# EAGLE design LIN-interface (EAGLE 6.2)
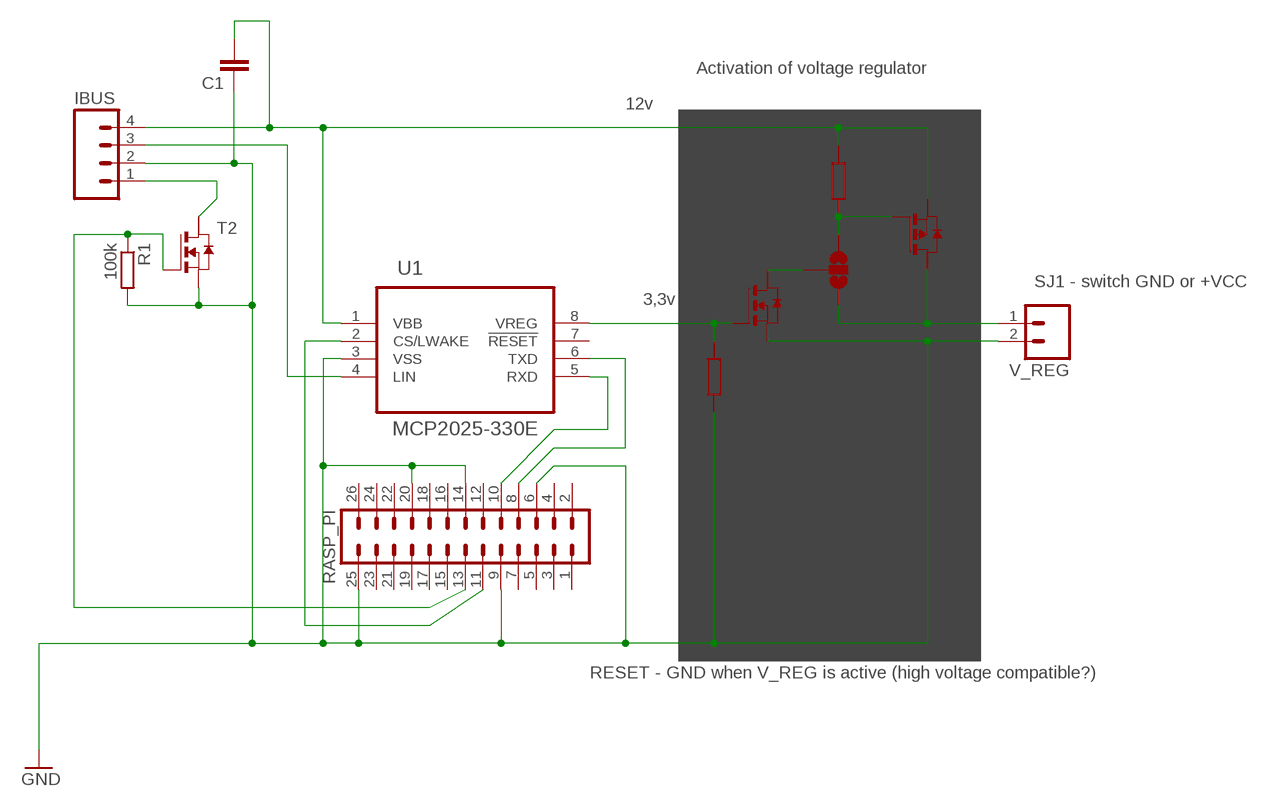
[diagram p0: schematic, sheet 1]

## Parts
C1  C-EUC1812  [C1812]
IBUS  M04  [04P]
R1  100k  R-EU_R5025  [R5025]
R2  100k  R-EU_R5025  [R5025]
R3  100k  R-EU_R5025  [R5025]
RASP_PI  MA13-2MIRRORED  [ML26-MIRRORED]
SJ1  SJ2W  [SJ_2]
T1  NMOSSOT223  [SOT223]
T2  NMOSSOT223  [SOT223]
T3  PMOSSOT223  [SOT223]
U1  MCP2025-330E  MCP2025-330E/PDIP08  [DIL08]
V_REG  M02  [02P]

## Nets
GND: C1.1 IBUS.2 R1.2 R2.2 RASP_PI.6 RASP_PI.9 RASP_PI.14 RASP_PI.20 RASP_PI.25 T1.3(S) T2.3(S) U1.3(VSS) V_REG.2
N$1: IBUS.3 U1.4(LIN)
N$2: SJ1.2 T1.2(D)
N$4: RASP_PI.8 U1.6(TXD)
N$5: RASP_PI.10 U1.5(RXD)
N$6: RASP_PI.11 U1.2(CS/LWAKE)
N$8: SJ1.3 T3.2(D) V_REG.1
N$9: IBUS.1 T2.2(D)
N$10: R3.2 SJ1.1 T3.1(G)
VBB: C1.2 IBUS.4 R3.1 T3.3(S) U1.1(VBB)
VIDEO_ON: R1.1 RASP_PI.13 T2.1(G)
VREG: R2.1 T1.1(G) U1.8(VREG)
Unconnected: RASP_PI.1 RASP_PI.2 RASP_PI.3 RASP_PI.4 RASP_PI.5 RASP_PI.7 RASP_PI.12 RASP_PI.15 RASP_PI.16 RASP_PI.17 RASP_PI.18 RASP_PI.19 RASP_PI.21 RASP_PI.22 RASP_PI.23 RASP_PI.24 RASP_PI.26 T1.4(D2) T2.4(D2) T3.4(D2) U1.7(!RESET)

## Notes on the sheet
- Activation of voltage regulator
- 12v
- SJ1 - switch GND or +VCC
- 3,3v
- RESET - GND when V_REG is active (high voltage compatible?)

## Library data of the parts
C1 = rcl:C-EU: CAPACITOR, European symbol
IBUS = con-amp-quick:M04: AMP QUICK CONNECTOR; OC_FARNELL: unknown; OC_NEWARK: unknown
R1-R3 = resistor:R-EU_: RESISTOR, European symbol
RASP_PI = con-lstb:MA13-2: PIN HEADER
SJ1 = jumper:SJ2W: SMD solder JUMPER
T1 T2 = zetex:NMOSSOT223: MOS FET; OC_FARNELL: unknown; OC_NEWARK: unknown
T3 = zetex:PMOSSOT223: MOS FET; OC_FARNELL: unknown; OC_NEWARK: unknown
U1 = LIN interface:MCP2025-330E/P: LIN Transceiver with Voltage Regulator,DIP-8; MPN: MCP2025-330E/P; OC_FARNELL: 2362832; OC_NEWARK: 12X8692; PACKAGE: DIP08; SUPPLIER: MICROCHIP
V_REG = con-amp-quick:M02: AMP QUICK CONNECTOR; OC_FARNELL: unknown; OC_NEWARK: unknown

## Board
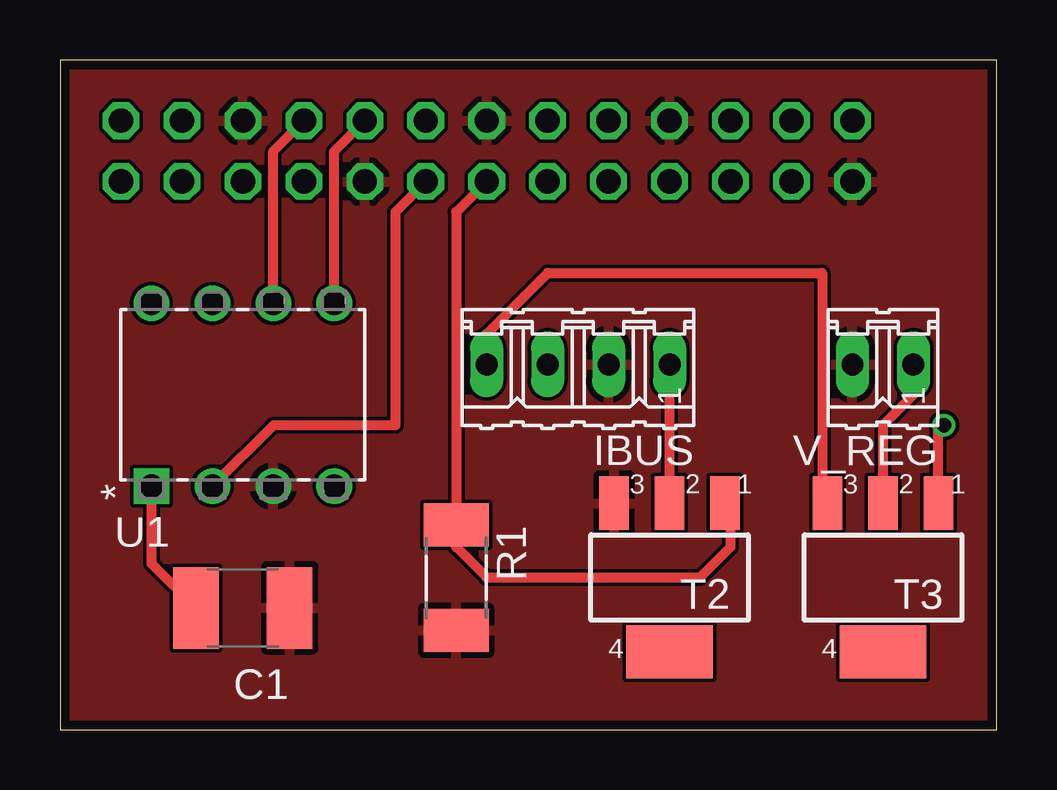
[diagram p1: board, top side]
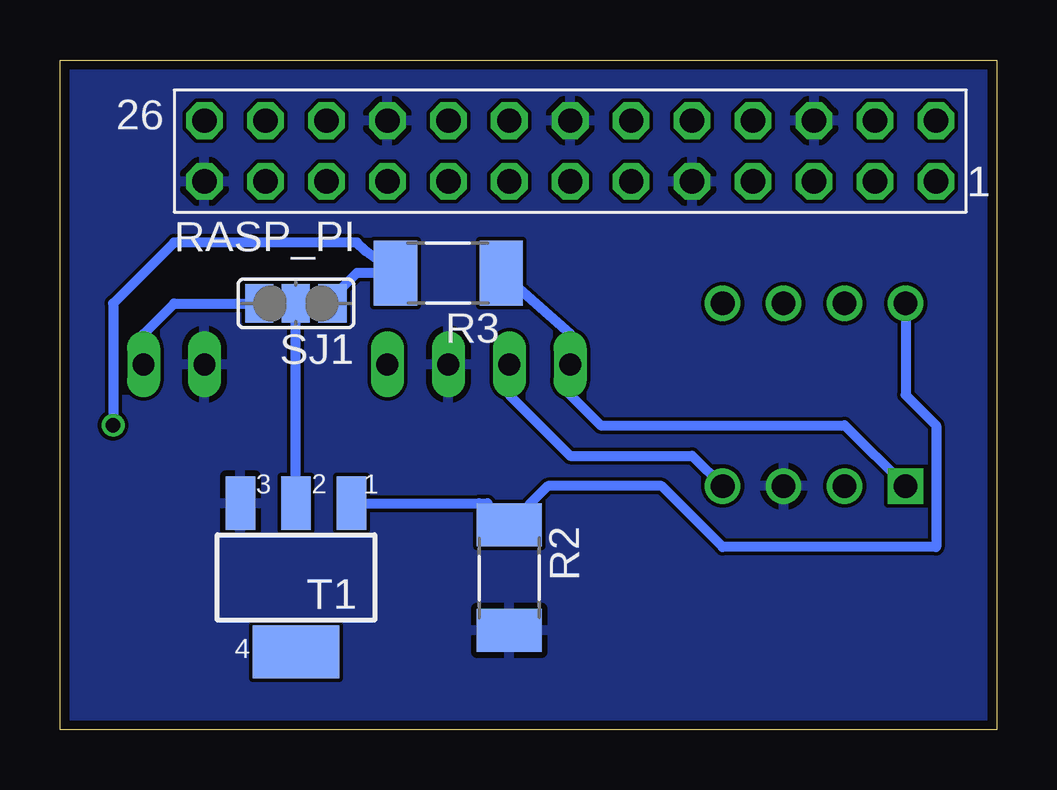
[diagram p2: board, bottom side, seen from below]

Size 39.04 x 27.93 mm. Coordinates in mm from the lower left corner, seen from the top.
Outline: 0,0 39.04,0 39.04,27.93 0,27.93 0,0
Copper layers (1*16): Top 0.0356mm / dielectric 1.5011mm / Bottom 0.0356mm
Design rules: minimum track width 6mil, minimum drill 13mil, track to track 6mil, track to pad 6mil, pad to pad 6mil, via to via 6mil, smd to smd 6mil, copper to edge 15mil, drill to drill 6mil, minimum pad ring 7mil, minimum via ring 7mil, stop-mask expansion 3mil, vias tented up to drill 0mil, thermal gap 10mil

### Footprints (pad centres in the part's own frame; a part is rotated, then mirrored left to right if it is on the bottom)
C1812 = smd 1.9 x 3.4: 1 -1.95,0; 2 1.95,0
04P = drill 0.914 long: 1 -3.81,0; 2 -1.27,0; 3 1.27,0; 4 3.81,0
R5025 = smd 1.8 x 2.7: 1 -2.2,0; 2 2.2,0
ML26-MIRRORED = drill 1.016 octagon: 1 15.24,-1.27; 2 15.24,1.27; 3 12.7,-1.27; 4 12.7,1.27; 5 10.16,-1.27; 6 10.16,1.27; 7 7.62,-1.27; 8 7.62,1.27; 9 5.08,-1.27; 10 5.08,1.27; 11 2.54,-1.27; 12 2.54,1.27; 13 0,-1.27; 14 0,1.27; 15 -2.54,-1.27; 16 -2.54,1.27; 17 -5.08,-1.27; 18 -5.08,1.27; 19 -7.62,-1.27; 20 -7.62,1.27; 21 -10.16,-1.27; 22 -10.16,1.27; 23 -12.7,-1.27; 24 -12.7,1.27; 25 -15.24,-1.27; 26 -15.24,1.27
SJ_2 = smd 1.168 x 1.6: 1 -1.524,0; 2 0,0; 3 1.524,0
SOT223 = smd 1.219 x 2.235: 1 -2.311,-3.099; 2 0,-3.099; 3 2.311,-3.099 | smd 3.6 x 2.2: 4 0,3.099
DIL08 = drill 0.991 square: 1 -3.81,-3.81 | drill 0.991: 2 -1.27,-3.81; 3 1.27,-3.81; 4 3.81,-3.81; 5 3.81,3.81; 6 1.27,3.81; 7 -1.27,3.81; 8 -3.81,3.81
02P = drill 0.914 long: 1 -1.27,0; 2 1.27,0

### Placement (x,y rotation side)
C1  7.62,5.08 180 top
IBUS  21.59,15.24 180 top
R1  16.51,6.35 270 top
R2  20.32,6.35 270 bottom
R3  22.86,19.05 180 bottom
RASP_PI  17.78,24.13 0 bottom
SJ1  29.21,17.78 180 bottom
T1  29.21,6.35 180 bottom
T2  25.4,6.35 180 top
T3  34.29,6.35 180 top
U1  7.62,13.97 0 top
V_REG  34.29,15.24 180 top

### Tracks (layer width: path | path; a pad name or v marks a point on that pad's centre or on a via)
GND
  pour Bottom: -1.27,29.21 40.64,29.21 40.64,-1.27 -1.27,-1.27
  pour Top: -1.27,29.21 40.64,29.21 40.64,-1.27 -1.27,-1.27
N$1
  Bottom 0.406: IBUS.3 20.32,13.97 17.78,11.43 12.7,11.43 U1.4
N$2
  Bottom 0.406: T1.2 SJ1.2
N$4
  Top 0.406: U1.6 8.89,24.13 RASP_PI.8
N$5
  Top 0.406: U1.5 11.43,24.13 RASP_PI.10
N$6
  Top 0.406: RASP_PI.11 13.97,21.59 13.97,12.7 8.89,12.7 U1.2
N$8
  Top 0.406: V_REG.1 35.56,13.97 34.29,12.7 T3.2
  Bottom 0.406: V_REG.1 35.56,16.51 34.29,17.78 SJ1.3
N$9
  Top 0.406: T2.2 IBUS.1
N$10  (via drill 0.6)
  Top 0.406: T3.1 36.6,12.47 v36.83,12.7
  Bottom 0.406: v36.83,12.7 36.83,17.78 34.29,20.32 26.67,20.32 26.33,19.98 R3.2 26.67,19.05 27.69,18.03 SJ1.1
VBB
  Top 0.406: U1.1 3.81,6.94 C1.2 | IBUS.4 17.78,16.51 20.32,19.05 31.75,19.05 31.75,9.68 T3.3
  Bottom 0.406: U1.1 6.35,12.7 16.51,12.7 17.78,13.97 IBUS.4 17.78,16.51 R3.1
VIDEO_ON
  Top 0.406: RASP_PI.13 16.51,21.59 R1.1 16.51,7.62 17.78,6.35 26.67,6.35 27.94,7.62 27.94,8.89 T2.1
VREG
  Bottom 0.406: T1.1 21.59,9.45 | 21.59,9.45 21.22,9.45 | U1.8 3.81,13.97 2.54,12.7 2.54,7.62 11.43,7.62 13.97,10.16 18.71,10.16 R2.1 20.69,8.55 21.59,9.45